# Altium schematic sheet 2_Airframe-Power_2 - Old.SchDoc
size A3; SheetNumber: 1; SheetTotal: 2
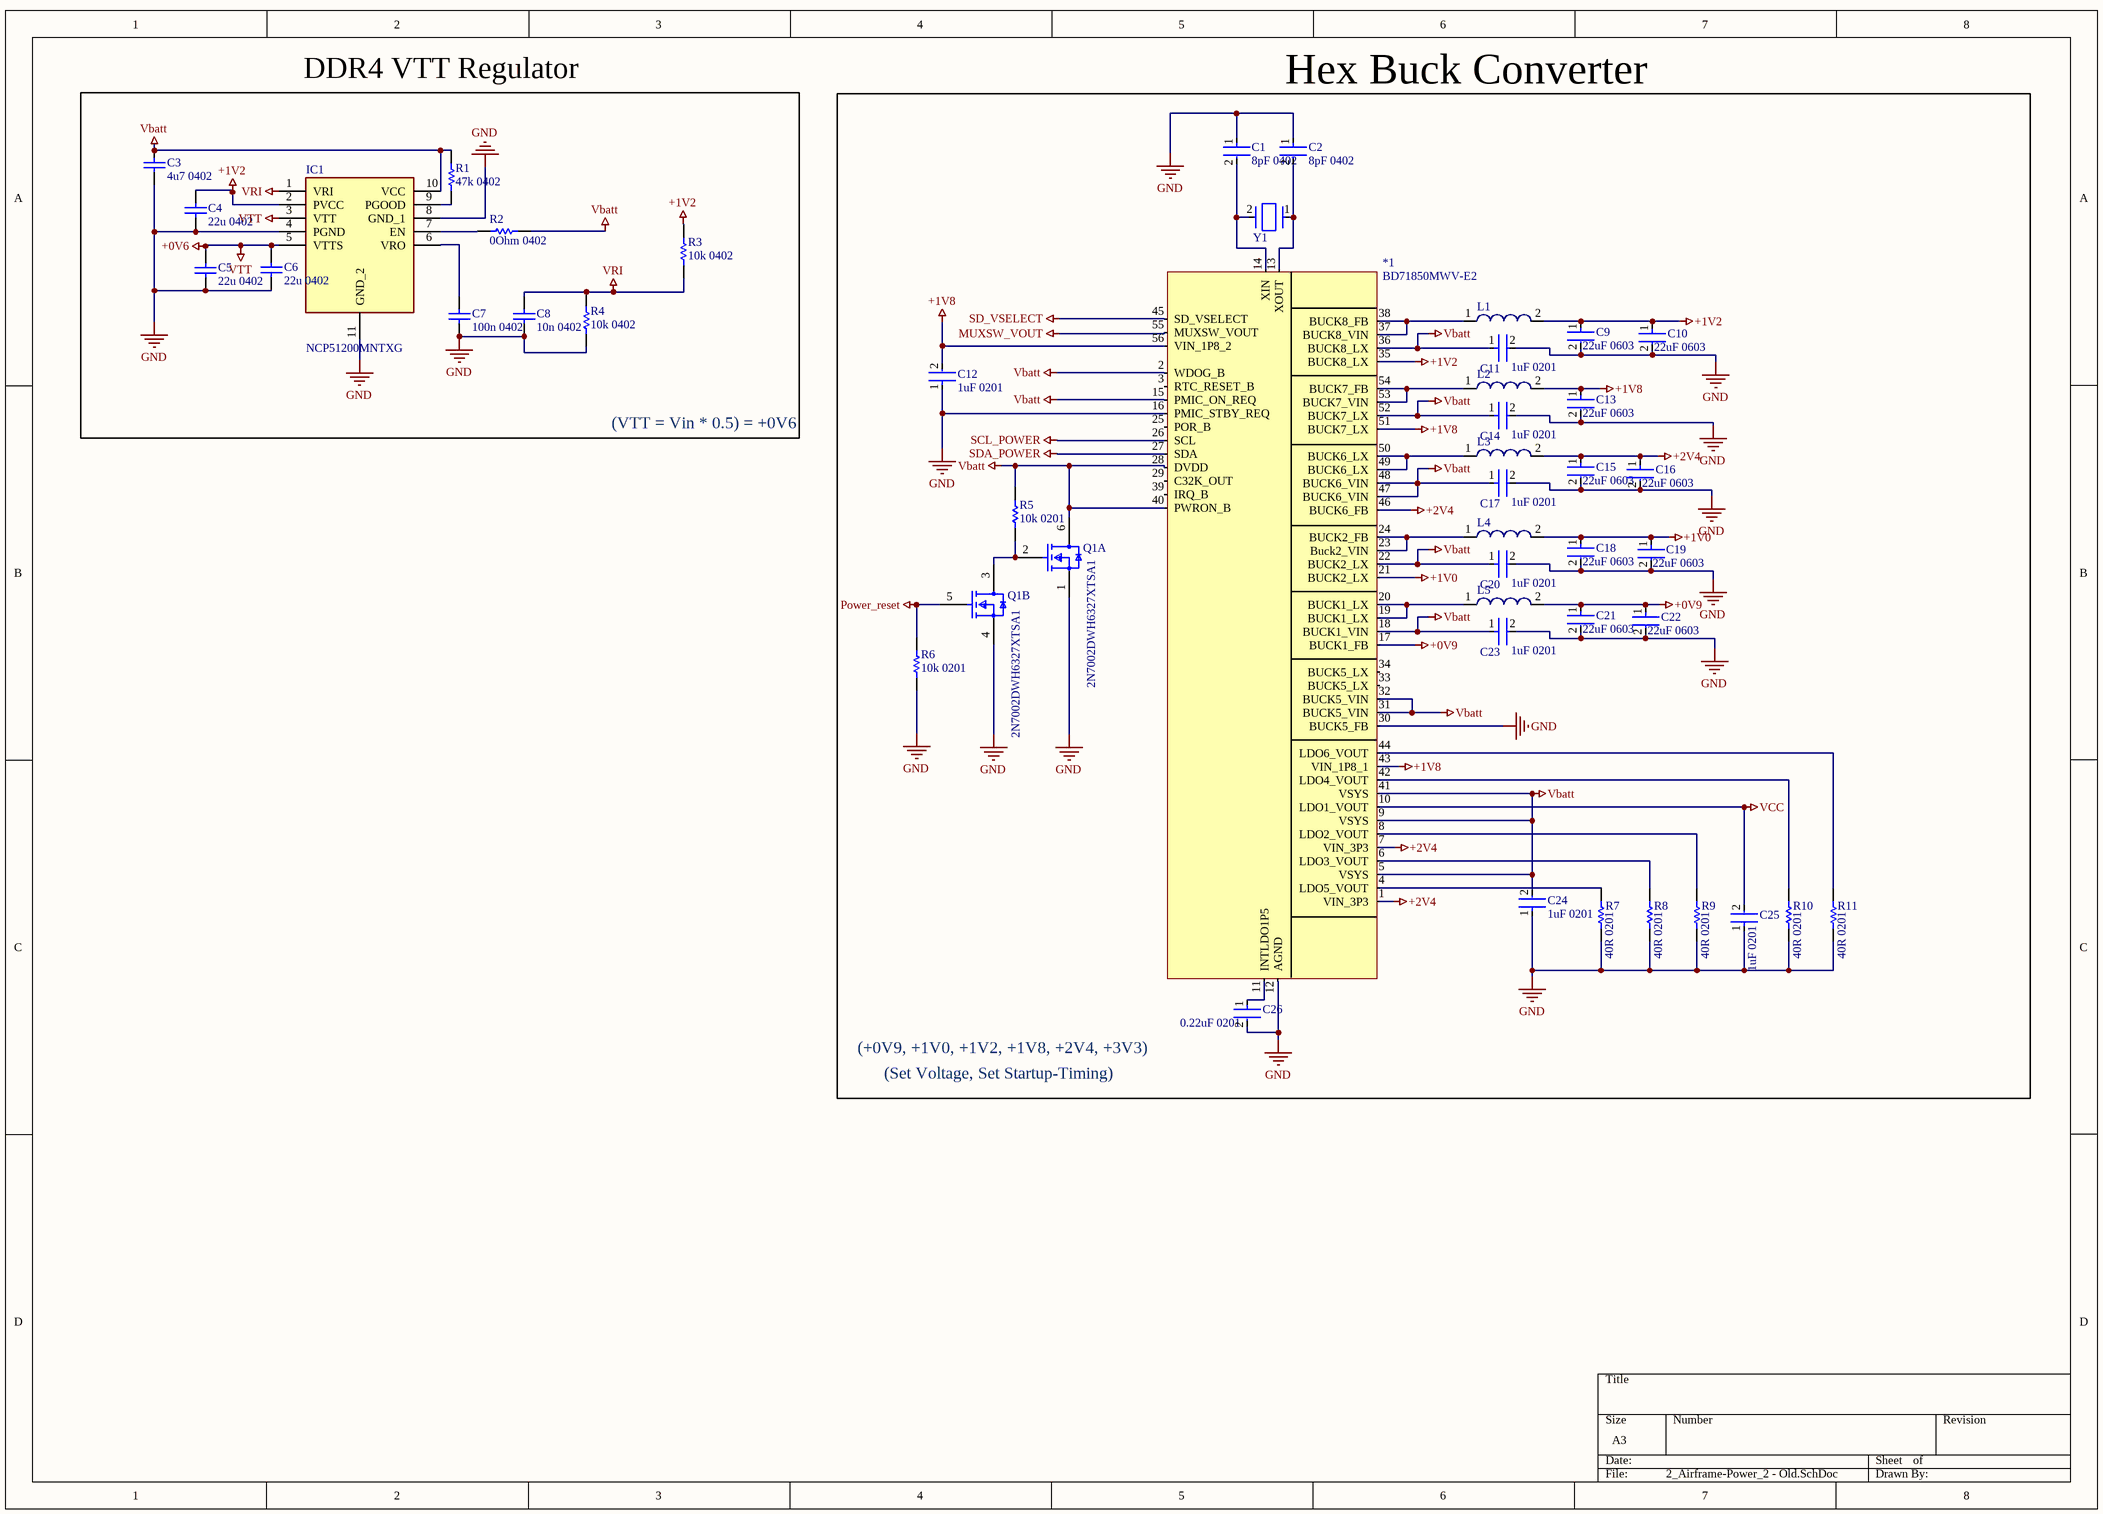
[diagram p0: 2_Airframe-Power_2 - Old.SchDoc]

## Parts
*1  BD71850MWV-E2  [QFN40P700X700X80_HS-57N]
C1  8pF 0402  [FP-C0402C225M9PACTU-MFG]
C2  8pF 0402  [FP-C0402C225M9PACTU-MFG]
C3  4u7 0402  [CAPC1005X55X25ML5T10]
C4  22u 0402  [CAPC1005X55X25ML5T10]
C5  22u 0402  [CAPC1005X55X25ML5T10]
C6  22u 0402  [CAPC1005X55X25ML5T10]
C7  100n 0402  [CAPC1005X55X25ML5T10]
C8  10n 0402  [CAPC1005X55X25ML5T10]
C9  22uF 0603  [FP-GRM188-0_2-IPC_C]
C10  22uF 0603  [FP-GRM188-0_2-IPC_C]
C11  1uF 0201  [FP-C0603-030-0_03-IPC_C]
C12  1uF 0201  [FP-C0603-030-0_03-IPC_C]
C13  22uF 0603  [FP-GRM188-0_2-IPC_C]
C14  1uF 0201  [FP-C0603-030-0_03-IPC_C]
C15  22uF 0603  [FP-GRM188-0_2-IPC_C]
C16  22uF 0603  [FP-GRM188-0_2-IPC_C]
C17  1uF 0201  [FP-C0603-030-0_03-IPC_C]
C18  22uF 0603  [FP-GRM188-0_2-IPC_C]
C19  22uF 0603  [FP-GRM188-0_2-IPC_C]
C20  1uF 0201  [FP-C0603-030-0_03-IPC_C]
C21  22uF 0603  [FP-GRM188-0_2-IPC_C]
C22  22uF 0603  [FP-GRM188-0_2-IPC_C]
C23  1uF 0201  [FP-C0603-030-0_03-IPC_C]
C24  1uF 0201  [FP-C0603-030-0_03-IPC_C]
C25  1uF 0201  [FP-C0603-030-0_03-IPC_C]
C26  0.22uF 0201  [FP-C0603-030-0_03-IPC_C]
IC1  NCP51200MNTXG  [SON50P300X300X100-11N]
L1  744040320047  [WE-LQS 3015]  (value not drawn)
L2  744040320047  [WE-LQS 3015]  (value not drawn)
L3  744040320047  [WE-LQS 3015]  (value not drawn)
L4  744040320047  [WE-LQS 3015]  (value not drawn)
L5  744040320047  [WE-LQS 3015]  (value not drawn)
Q1  2N7002DWH6327XTSA1  [FP-PG-SOT363-6-MFG]  (parts A,B of 2)
R1  47k 0402  [RESC1608X55X25ML10T15]
R2  0Ohm 0402  [RESC1608X55X25ML10T15]
R3  10k 0402  [RESC1608X55X25ML10T15]
R4  10k 0402  [RESC1608X55X25ML10T15]
R5  10k 0201  [RESC0603X28X15NL05T05]
R6  10k 0201  [RESC0603X28X15NL05T05]
R7  40R 0201  [RESC0603X28X15NL05T05]
R8  40R 0201  [RESC0603X28X15NL05T05]
R9  40R 0201  [RESC0603X28X15NL05T05]
R10  40R 0201  [RESC0603X28X15NL05T05]
R11  40R 0201  [RESC0603X28X15NL05T05]
Y1  ABS06-32.768KHZ-9-T  [FP-ABS06-MFG]  (value not drawn)

## Blocks framed on the sheet
(VTT = Vin * 0.5) = +0V6: C3-C8 IC1 R1-R4

## Nets
+0V6: C5.1 C6.1 IC1.3(VTT) IC1.5(VTTS)  [also labelled VTT]
+0V9: *1.17(BUCK1_FB) C21.1 C22.1 L5.2
+1V0: *1.21(BUCK2_LX) C18.1 C19.1 L4.2
+1V2: *1.35(BUCK8_LX) C4.1 C9.1 C10.1 IC1.2(PVCC) L1.2 R3.1
+1V8: *1.43(VIN_1P8_1) *1.51(BUCK7_LX) *1.56(VIN_1P8_2) C12.2 C13.1 L2.2
+2V4: *1.1(VIN_3P3) *1.7(VIN_3P3) *1.46(BUCK6_FB) C15.1 C16.1 L3.2
GND: *1.12(AGND) *1.16(PMIC_STBY_REQ) *1.30(BUCK5_FB) C1.1 C2.1 C3.2 C4.2 C5.2 C6.2 C7.2 C8.2 C9.2 C10.2 C11.2 C12.1 C13.2 C14.2 C15.2 C16.2 C17.2 C18.2 C19.2 C20.2 C21.2 C22.2 C23.2 C24.1 C25.1 C26.2 IC1.4(PGND) IC1.8(GND_1) IC1.11(GND_2) Q1.1(S1) Q1.4(S2) R4.2 R6.1 R7.1 R8.1 R9.1 R10.1 R11.1
MUXSW_VOUT: *1.55(MUXSW_VOUT)
Power_reset: Q1.5(G2) R6.2
SCL_POWER: *1.26(SCL)
SD_VSELECT: *1.45(SD_VSELECT)
SDA_POWER: *1.27(SDA)
Vbatt: *1.2(WDOG_B) *1.5(VSYS) *1.9(VSYS) *1.15(PMIC_ON_REQ) *1.18(BUCK1_VIN) *1.22(BUCK2_LX) *1.28(DVDD) *1.31(BUCK5_VIN) *1.32(BUCK5_VIN) *1.36(BUCK8_LX) *1.40(PWRON_B) *1.41(VSYS) *1.47(BUCK6_VIN) *1.48(BUCK6_VIN) *1.52(BUCK7_LX) C3.1 C11.1 C14.1 C17.1 C20.1 C23.1 C24.2 IC1.10(VCC) Q1.6(D1) R1.2 R2.1 R5.2
VCC: *1.10(LDO1_VOUT) C25.2
VRI: C8.1 IC1.1(VRI) R3.2 R4.1
Net*1_4: *1.4(LDO5_VOUT) R7.2
Net*1_6: *1.6(LDO3_VOUT) R8.2
Net*1_8: *1.8(LDO2_VOUT) R9.2
Net*1_11: *1.11(INTLDO1P5) C26.1
Net*1_13: *1.13(XOUT) C2.2 Y1.1
Net*1_14: *1.14(XIN) C1.2 Y1.2
Net*1_19: *1.19(BUCK1_LX) *1.20(BUCK1_LX) L5.1
Net*1_23: *1.23(Buck2_VIN) *1.24(BUCK2_FB) L4.1
Net*1_37: *1.37(BUCK8_VIN) *1.38(BUCK8_FB) L1.1
Net*1_42: *1.42(LDO4_VOUT) R10.2
Net*1_44: *1.44(LDO6_VOUT) R11.2
Net*1_49: *1.49(BUCK6_LX) *1.50(BUCK6_LX) L3.1
Net*1_53: *1.53(BUCK7_VIN) *1.54(BUCK7_FB) L2.1
NetC7_1: C7.1 IC1.6(VRO)
NetIC1_7: IC1.7(EN) R2.2
NetIC1_9: IC1.9(PGOOD) R1.1
NetQ1_2: Q1.2(G1) Q1.3(D2) R5.1

Not connected (* = marked no-connect by the designer): *1 3(RTC_RESET_B) 25(POR_B) 29(C32K_OUT) 33(BUCK5_LX) 34(BUCK5_LX) 39(IRQ_B)

## Notes on the sheet
- DDR4 VTT Regulator
- Hex Buck Converter
- (+0V9, +1V0, +1V2, +1V8, +2V4, +3V3)
- (Set Voltage, Set Startup-Timing)

## Library data of the parts
*1 = CMP-00001-2: Step Down DC-DC Converter with LDO Regulator 12-OUT 56-Pin UQFN Emboss T/R PMIC i.MX 8M Nano UQFN56BV7070; Number of Outputs: 12; Voltage - Output 2: 1.3V; Switching Frequency: 2MHz; Voltage - Output 3: 1.35V; Min Operating Temperature: -40°C; Max Operating Temperature: 85°C; Mount: Surface Mount; ComponentLink1URL: https://eu.mouser.com/ProductDetail/ROHM-Semiconductor/BD71850MWV-E2?qs=Cb2nCFKsA8q%2FlLq8hwnX9w%3D%3D; RoHS Compliant: Yes; Voltage - Output 1: 1.3V; ComponentLink1Description: Link:; Series: -
C1 C2 = CMP-2008-02064-3: CAP CER 2.2UF 6.3V X5R 0402; Tolerance: 20%; Dissipation Factor: 5%; Dielectric Material: Ceramic; Lead Free: Lead Free; Depth: 0.5mm; Series: C; Termination: SMD/SMT; Case Code (Metric): 1005; Case/Package: 0402; Dielectric: X5R; RoHS Compliant: Yes; Thickness: 0.022inch; Voltage Rating: 6.3V; Voltage: 6.3V; Height: 0.5mm; Mount: Surface Mount; Construction: Flat; Case Code (Imperial): 0402; Min Operating Temperature: -55°C; Contact Plating: Tin; Radiation Hardening: No; Number of Pins: 2; Voltage Rating (DC): 6.3V; Capacitance: 2.2uF; Width: 0.5mm; Package Quantity: 1; Packaging: Tape and Reel; Max Operating Temperature: 85°C; Length: 1mm; REACH SVHC: No SVHC
C3-C8 = CMP-1662-00017-1: Chip Capacitor, 1 nF, +/- 10%, 50 V, -55 to 125 degC, 0402 (1005 Metric), RoHS, Tape and Reel; Case\/Package: 0402; Type (Capacitors): X7R; Voltage Rating (DC): 50 V; Capacitance: 1 nF; Width: 0.5 mm; Pins: 2; REACH SVHC: No SVHC; Length: 1 mm; Height: 0.5 mm; PackageDescription: 2-Pin Surface Mount Device, Body 1 x 0.5 mm; DatasheetVersion: 07/2016; Mount: Surface Mount; ComponentLink2Description: Datasheet; Tolerance: 10%; ComponentLink2URL: http://psearch.en.murata.com/capacitor/product/GRM155R71H102KA01%23.pdf; ComponentLink1URL: http://www.murata.com/; Case Code (Metric): 1005; Package Quantity: 10000; Min Operating Temperature: -55 degC; Max Operating Temperature: 125 degC; Voltage Rating: 50 V; ComponentLink1Description: Manufacturer URL; Packaging: Tape and Reel; Radiation Hardening: No; RoHSCompliant: true; PackageReference: 0402; Mounting Technology: Surface Mount; Case Code (Imperial): 0402
C9 C10 C13 C15 C16 C18 C19 C21 C22 = CMP-2000-06337-3: Chip Multilayer Ceramic Capacitors for General Purpose, 0603, 22uF, X5R, 15%, 20%, 10V; Tolerance: 20%; Weight: 0.000222oz; Material: Ceramic; Depth: 0.8mm; Length: 1.6mm; Termination: SMD/SMT; Capacitance: 22uF; Packaging: Tape and Reel; Width: 0.8mm; Voltage Rating: 10V; Case Code (Imperial): 0603; Mount: Surface Mount; Voltage Rating (DC): 10V; Case/Package: 0603; Thickness: 0.039inch; REACH SVHC: No SVHC; Dielectric: X5R; Height: 0.8mm; Package Quantity: 4000; Case Code (Metric): 1608; Min Operating Temperature: -55°C; Lead Free: Lead Free; Max Operating Temperature: 85°C
C11 C12 C14 C17 C20 C23-C26 = CMP-08246-007095-1: Multilayer Ceramic Capacitors 220nF ±10% 6.3V X6S SMD 0201; Dielectric: X6S; Resistor Type: Ceramic; Length: 0.6mm; Capacitance: 220nF; Case Code (Metric): 0603; Series: C; Width: 0.012inch; Height: 0.3mm; Voltage Rating: 6.3V; Max Operating Temperature: 105°C; REACH SVHC: No SVHC; RoHS Compliant: Yes; Tolerance: 10%; Termination: SMD/SMT; Case/Package: 0201; Case Code (Imperial): 0201; Weight: 6E-06oz; Lead Free: Lead Free; Construction: Flat; Thickness: 300um; Mount: Surface Mount; Dielectric Material: Ceramic; Voltage Rating (DC): 6.3V; Packaging: Cut Tape; Package Quantity: 1; Min Operating Temperature: -55°C; Depth: 0.3mm
IC1 = NCP51200MNTXG: Integrated Circuit; Manufacturer_Name: onsemi; Datasheet Link: http://www.onsemi.com/pub/Collateral/NCP51200-D.PDF; Height: 1mm; Manufacturer_Part_Number: NCP51200MNTXG; Mouser Part Number: 863-NCP51200MNTXG; Mouser Price/Stock: https://www.mouser.co.uk/ProductDetail/onsemi/NCP51200MNTXG?qs=mt7EBqA2jzgnxcGILBvARw%3D%3D; Arrow Part Number: NCP51200MNTXG; Arrow Price/Stock: https://www.arrow.com/en/products/ncp51200mntxg/on-semiconductor?region=europe
L1-L5 = CMP-1354-00019-1: WE-LQS SMD Power Inductor, L=0.47; Manufacturer: Wuerth Elektronik; Inductance: 0.47 ÂµH; PartNumber: 744040320047; ComponentLink2URL: http://katalog.we-online.de/pbs/datasheet/744040320047.pdf; ComponentLink1URL: http://www.we-online.com; ComponentLink1Description: Manufacturer URL; ComponentLink2Description: Datasheet; PackageReference: WE-LQS 3015
Q1 = CMP-32901-000186-1: MOSFET 2N-CH 60V 0.3A SOT363; Rise Time: 3.3ns; Turn-On Delay Time: 3ns; Continuous Drain Current (ID): 300mA; FET Type: 2 N-Channel; Input Capacitance: 20pF; Power Dissipation: 500mW; Number of Elements: 2; Gate to Source Voltage (Vgs): 20V; Rds On Max: 3R; Fall Time: 3.1ns; Turn-Off Delay Time: 5.5ns; Mount: Surface Mount; Lead Free: Lead Free; REACH SVHC: No SVHC; Halogen Free: Halogen Free; Drain to Source Voltage (Vdss): 60V; Packaging: Tape and Reel; Max Power Dissipation: 500mW; Number of Pins: 6; Max Dual Supply Voltage: 60V; Case/Package: SOT-363-6; Max Operating Temperature: 150°C; Min Operating Temperature: -55°C
R1 R3 R4 = CMP-2100-03667-1: Manufacturer: Yageo; Temperature Coefficient: 200ppm/degreesC; Tolerance: 5%; Voltage Rating: 50V; Power Rating: 100mW; Resistance: 0mOhm; Width: 0.8mm; Max Operating Temperature: 155degC; Package Reference: 0603; Height: 0.45mm; Depth: 0.8mm; Package Description: 2-Pin Surface Mount Device, Body 1.6 x 0.8 mm; Termination: SMD/SMT; Package Quantity: 5000; Case/Package: 0603; Case Code (Imperial): 0603; Radiation Hardening: No; Number of Pins: 2; Length: 1.6mm; Lead Free: LeadFree; Voltage Rating (DC): 50V; Military Standard: Not; Datasheet URL: http://www.yageo.com/NewPortal/yageodocoutput?fileName=/pdf/R-Chip/PYu-RC_Group_51_RoHS_L_5.pdf; Manufacturer URL: http://www.yageo.com/; Packaging: TapeandReel; Case Code (Metric): 1608; Min Operating Temperature: -55degC; Composition: ThickFilm; RoHSCompliant: true; Contact Plating: Tin; Datasheet Version: Rev. 5, 10/2016; REACH SVHC: NoSVHC
R2 = CMP-2100-03667-1: Chip Resistor, 0 Ohm, +/- 5%, 0.1 W, -55 to 155 degC, 0603 (1608 Metric), RoHS, Tape and Reel; Manufacturer: Yageo; Temperature Coefficient: 200ppm/degreesC; Voltage Rating: 50V; Power Rating: 100mW; Resistance: 0mOhm; Width: 0.8mm; Max Operating Temperature: 155degC; Tolerance: 5%; Package Reference: 0603; Height: 0.45mm; Depth: 0.8mm; Package Description: 2-Pin Surface Mount Device, Body 1.6 x 0.8 mm; Termination: SMD/SMT; Package Quantity: 5000; Case/Package: 0603; Case Code (Imperial): 0603; Radiation Hardening: No; Number of Pins: 2; Length: 1.6mm; Lead Free: LeadFree; Voltage Rating (DC): 50V; Military Standard: Not; Datasheet URL: http://www.yageo.com/NewPortal/yageodocoutput?fileName=/pdf/R-Chip/PYu-RC_Group_51_RoHS_L_5.pdf; Manufacturer URL: http://www.yageo.com/; Packaging: TapeandReel; Case Code (Metric): 1608; Min Operating Temperature: -55degC; Composition: ThickFilm; RoHSCompliant: true; Contact Plating: Tin; Datasheet Version: Rev. 5, 10/2016; REACH SVHC: NoSVHC
R5 R6 = CMP-2004-00016-1: Manufacturer: Vishay Dale; Part Number: CRCW020110K0FNED
R7-R11 = CMP-2004-00006-1: Manufacturer: Vishay; Part Number: CRCW0201100RFNED
Y1 = CMP-27762-015421-1: Crystal 32.768kHz ±20ppm (Tol) 9pF FUND 90kΩ 2-Pin Mini-CSMD T/R; ESR (Equivalent Series Resistance): 90kR; Max Operating Temperature: 85°C; Frequency Tolerance: 20ppm; Case/Package: CSMD; Termination: SMD/SMT; RoHS Compliant: Yes; Height: 0.6mm; Load Capacitance: 9pF; Packaging: Tape and Reel; Depth: 1.2mm; Tolerance: 20ppm; Frequency: 32.768kHz; Series: ABS06; Width: 1.2mm; Length: 2mm; Number of Pins: 2; Min Operating Temperature: -40°C; Mount: Surface Mount; Lead Free: Lead Free; Package Quantity: 3000